# EAGLE design sensorboard (EAGLE 8.1.0)
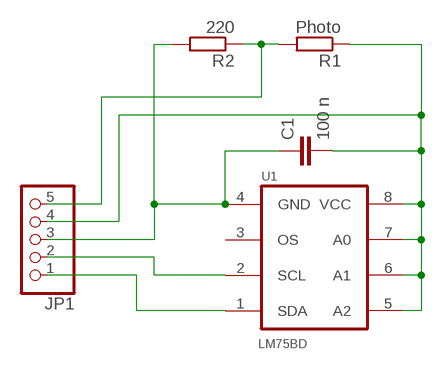
[diagram p0: schematic, sheet 1]

## Parts
C1  100 n  C-EUC0805  [C0805]
JP1  PINHD-1X5/90  [1X05/90]
R1  Photo  R-EU_0207/15  [0207/15]
R2  220  R-EU_R0805  [R0805]
U1  LM75BD  [SOIC127P600X175-8N]

## Nets
N$1: C1.1 JP1.3 R2.2 U1.4(GND)
N$2: C1.2 JP1.4 R1.1 U1.5(A2) U1.6(A1) U1.7(A0) U1.8(VCC)
N$3: JP1.2 U1.2(SCL)
N$4: JP1.1 U1.1(SDA)
N$5: JP1.5 R1.2 R2.1
Unconnected: U1.3(OS)

## Library data of the parts
C1 = resistor:C-EU: CAPACITOR, European symbol
JP1 = pinhead:PINHD-1X5: PIN HEADER
R1 R2 = resistor:R-EU_: RESISTOR, European symbol
U1 = esp_adapter:LM75BD: Digital temperature sensor and thermal watchdog; MPN: LM75BD; OC_FARNELL: 1854077; OC_NEWARK: 39T1312; PACKAGE: SO-8; SUPPLIER: NXP

## Board
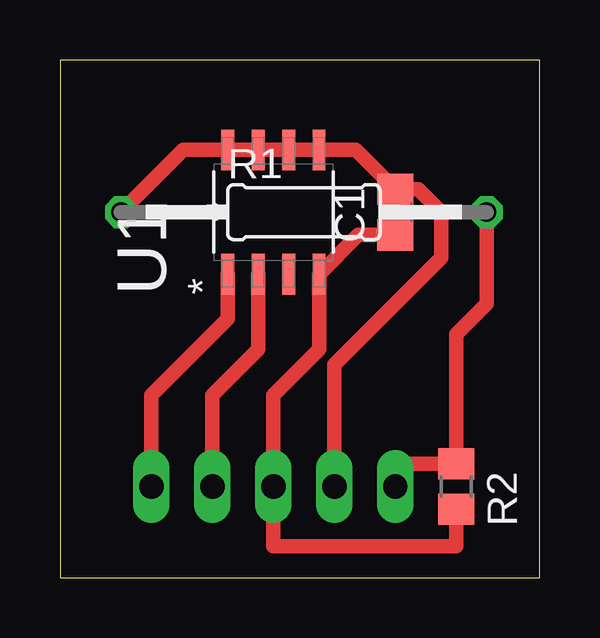
[diagram p1: board, top side]
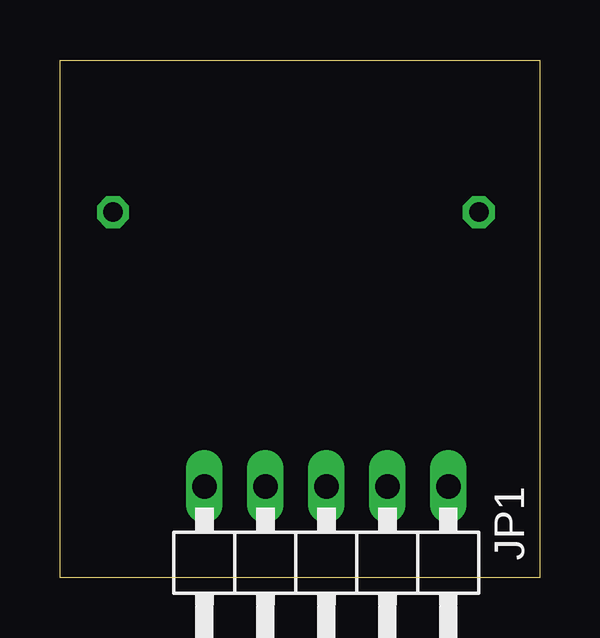
[diagram p2: board, bottom side, seen from below]

Size 19.99 x 21.58 mm. Coordinates in mm from the lower left corner, seen from the top.
Outline: 0,0 19.99,0 19.99,21.58 0,21.58 0,0
Copper layers (1*16): Top 0.035mm / dielectric 1.5mm / Bottom 0.035mm
Design rules "default": minimum track width 10mil, minimum drill 24mil, track to track 8mil, track to pad 8mil, pad to pad 8mil, via to via 8mil, smd to smd 8mil, copper to edge 40mil, drill to drill 8mil, minimum pad ring 10mil, minimum via ring 8mil, stop-mask expansion 4mil, vias tented up to drill 0mil, thermal gap 10mil

### Footprints (pad centres in the part's own frame; a part is rotated, then mirrored left to right if it is on the bottom)
C0805 = smd 1.3 x 1.5: 1 -0.95,0; 2 0.95,0
1X05/90 = drill 1.016 long: 1 -5.08,-3.81; 2 -2.54,-3.81; 3 0,-3.81; 4 2.54,-3.81; 5 5.08,-3.81
0207/15 = drill 0.813 octagon: 1 -7.62,0; 2 7.62,0
R0805 = smd 1.3 x 1.5: 1 -0.95,0; 2 0.95,0
SOIC127P600X175-8N = smd 1.702 x 0.533: 1 -2.591,1.905; 2 -2.591,0.635; 3 -2.591,-0.635; 4 -2.591,-1.905; 5 2.591,-1.905; 6 2.591,-0.635; 7 2.591,0.635; 8 2.591,1.905

### Placement (x,y rotation side)
C1  13.97,15.24 90 top
JP1  8.89,0 180 bottom
R1  10.16,15.24 0 top
R2  16.51,3.81 270 top
U1  8.89,15.24 90 top

### Tracks (layer width: path | path; a pad name or v marks a point on that pad's centre or on a via)
N$1
  Top 0.61: C1.1 12.44,14.29 U1.4 10.79,9.53 8.89,7.62 JP1.3 8.89,1.32 16.51,1.32 R2.2
N$2
  Top 0.61: JP1.4 11.43,8.89 13.97,11.43 15.24,12.7 15.88,13.34 15.88,15.24 14.93,16.19 C1.2 12.33,17.83 U1.5 | 10.85,17.78 U1.5 | U1.5 U1.6 U1.7 U1.8 5.13,17.83 R1.1
N$3
  Top 0.61: U1.2 8.26,9.53 6.35,7.62 JP1.2
N$4
  Top 0.61: U1.1 6.99,10.79 3.81,7.62 JP1.1
N$5
  Top 0.61: JP1.5 13.97,4.76 R2.1 16.51,10.16 17.78,11.43 R1.2